# EAGLE design LB-01 (EAGLE 7.3.0)
PROJECT_NAME: LMB 01- Mixer; REVISION: 1
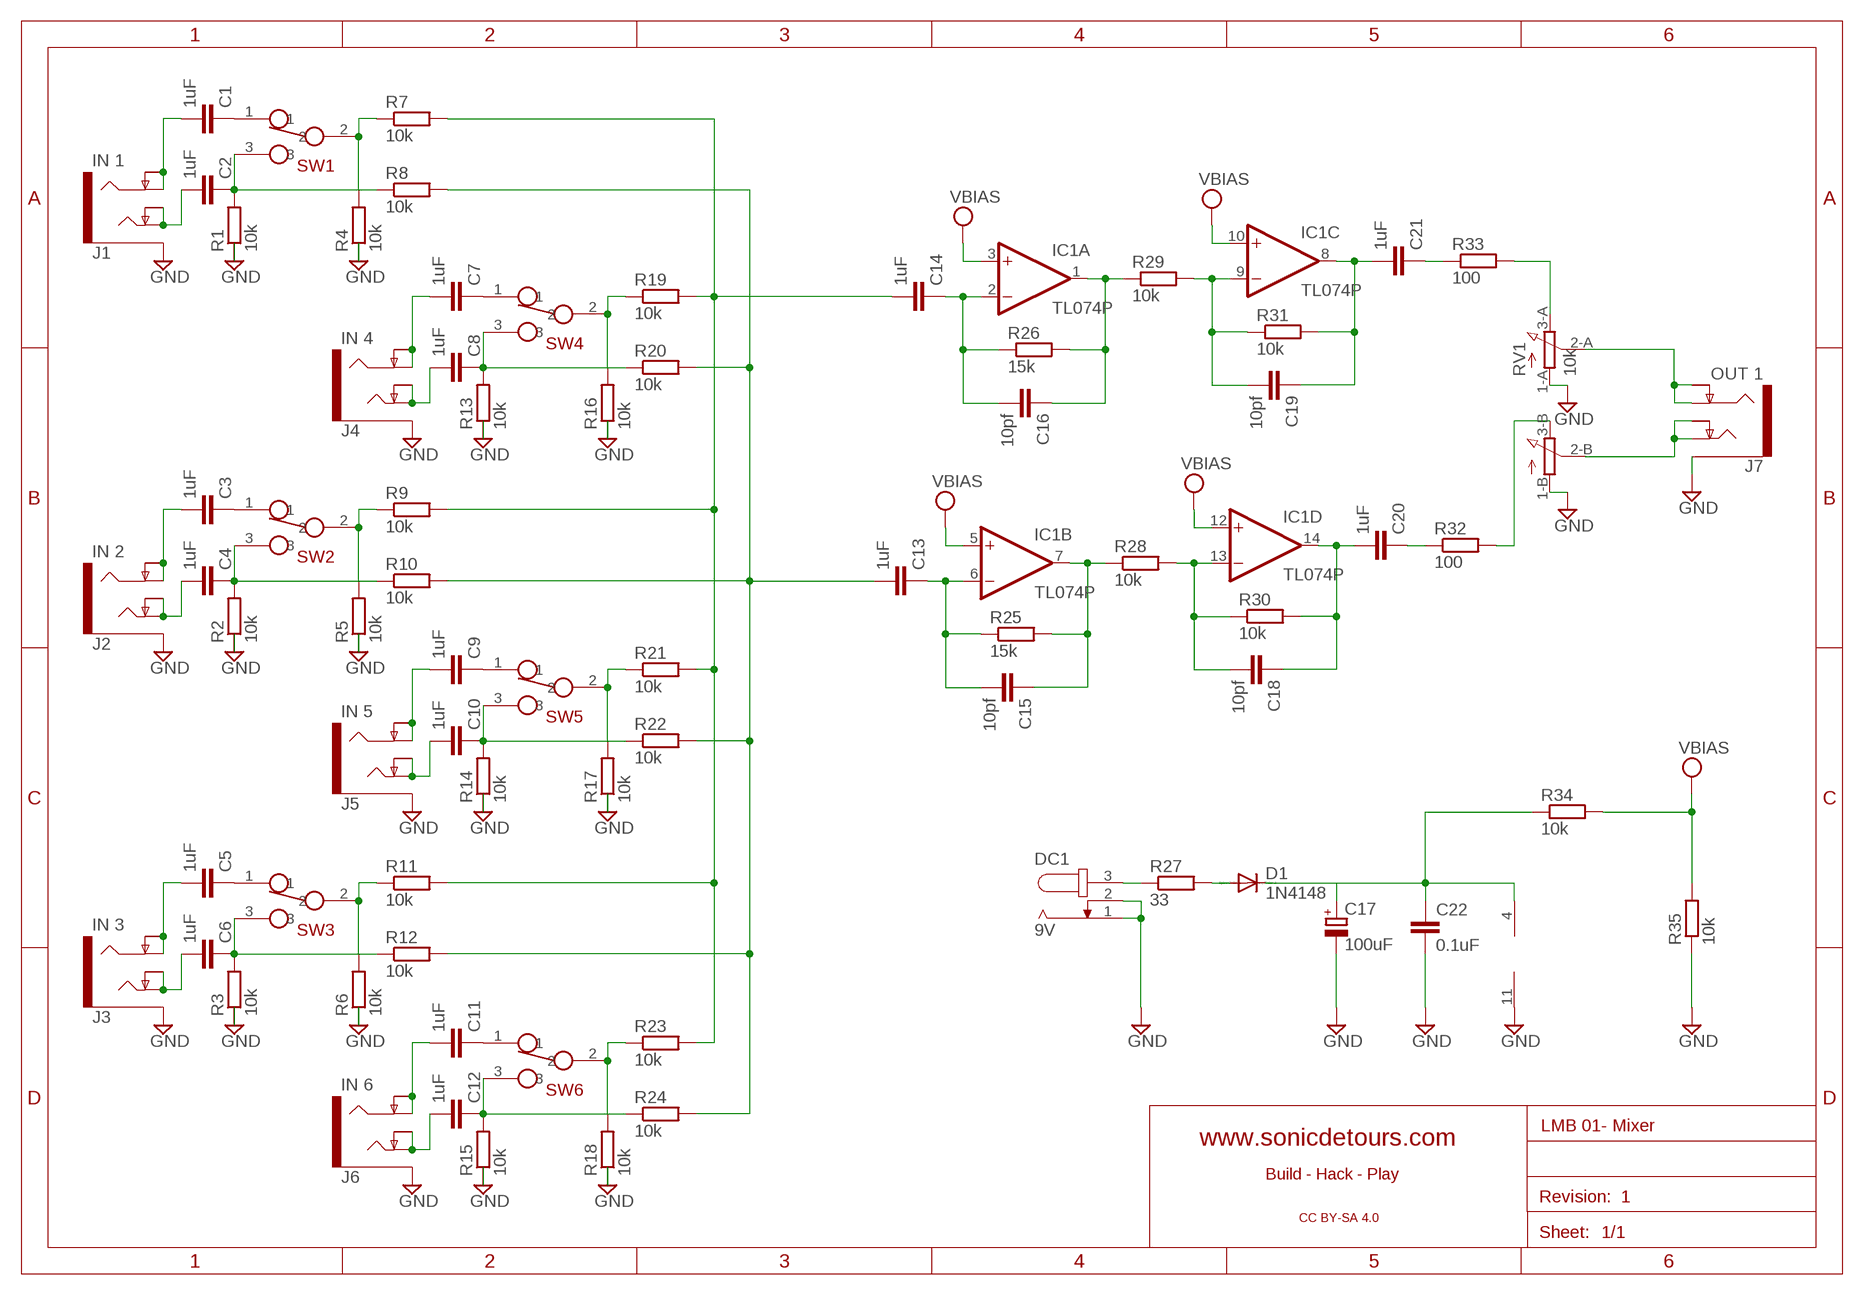
[diagram p0: schematic, sheet 1]

## Parts
C1  1uF  C50-50  [C-50-50]
C2  1uF  C50-50  [C-50-50]
C3  1uF  C50-50  [C-50-50]
C4  1uF  C50-50  [C-50-50]
C5  1uF  C50-50  [C-50-50]
C6  1uF  C50-50  [C-50-50]
C7  1uF  C50-50  [C-50-50]
C8  1uF  C50-50  [C-50-50]
C9  1uF  C50-50  [C-50-50]
C10  1uF  C50-50  [C-50-50]
C11  1uF  C50-50  [C-50-50]
C12  1uF  C50-50  [C-50-50]
C13  1uF  C50-50  [C-50-50]
C14  1uF  C50-50  [C-50-50]
C15  10pf  C25  [C-25]
C16  10pf  C25  [C-25]
C17  100uF  C-POL2.5-05  [C-POL-2.5-05]
C18  10pf  C25  [C-25]
C19  10pf  C25  [C-25]
C20  1uF  C50-50  [C-50-50]
C21  1uF  C50-50  [C-50-50]
C22  0.1uF  C25  [C-25]
D1  1N4148  1N4148DO35-10  [DO35-10]
DC1  9V  DC-JACK  [DC-JACK]
IC1  TL074P  [DIL14]
J1  IN 1  STEREO_JACK3.5MM  [STEREO_JACK_3.5MM]
J2  IN 2  STEREO_JACK3.5MM  [STEREO_JACK_3.5MM]
J3  IN 3  STEREO_JACK3.5MM  [STEREO_JACK_3.5MM]
J4  IN 4  STEREO_JACK3.5MM  [STEREO_JACK_3.5MM]
J5  IN 5  STEREO_JACK3.5MM  [STEREO_JACK_3.5MM]
J6  IN 6  STEREO_JACK3.5MM  [STEREO_JACK_3.5MM]
J7  OUT 1  STEREO_JACK3.5MM  [STEREO_JACK_3.5MM]
R1  10k  R  [R-7.62MM]
R2  10k  R  [R-7.62MM]
R3  10k  R  [R-7.62MM]
R4  10k  R  [R-7.62MM]
R5  10k  R  [R-7.62MM]
R6  10k  R  [R-7.62MM]
R7  10k  R  [R-7.62MM]
R8  10k  R  [R-7.62MM]
R9  10k  R  [R-7.62MM]
R10  10k  R  [R-7.62MM]
R11  10k  R  [R-7.62MM]
R12  10k  R  [R-7.62MM]
R13  10k  R  [R-7.62MM]
R14  10k  R  [R-7.62MM]
R15  10k  R  [R-7.62MM]
R16  10k  R  [R-7.62MM]
R17  10k  R  [R-7.62MM]
R18  10k  R  [R-7.62MM]
R19  10k  R  [R-7.62MM]
R20  10k  R  [R-7.62MM]
R21  10k  R  [R-7.62MM]
R22  10k  R  [R-7.62MM]
R23  10k  R  [R-7.62MM]
R24  10k  R  [R-7.62MM]
R25  15k  R  [R-7.62MM]
R26  15k  R  [R-7.62MM]
R27  33  R  [R-7.62MM]
R28  10k  R  [R-7.62MM]
R29  10k  R  [R-7.62MM]
R30  10k  R  [R-7.62MM]
R31  10k  R  [R-7.62MM]
R32  100  R  [R-7.62MM]
R33  100  R  [R-7.62MM]
R34  10k  R  [R-7.62MM]
R35  10k  R  [R-7.62MM]
RV1  10k  POT-DUALBOURNS-PTA4544  [POT-DUAL-PTA4544]
SW1  SWITCH-SPDT  [SWITCH-SPDT-SMALL]
SW2  SWITCH-SPDT  [SWITCH-SPDT-SMALL]
SW3  SWITCH-SPDT  [SWITCH-SPDT-SMALL]
SW4  SWITCH-SPDT  [SWITCH-SPDT-SMALL]
SW5  SWITCH-SPDT  [SWITCH-SPDT-SMALL]
SW6  SWITCH-SPDT  [SWITCH-SPDT-SMALL]

## Nets
GND: C17.- C22.2 DC1.1 DC1.2 IC1.11(P:V-) J1.SLEEVE(EARTH) J2.SLEEVE(EARTH) J3.SLEEVE(EARTH) J4.SLEEVE(EARTH) J5.SLEEVE(EARTH) J6.SLEEVE(EARTH) J7.SLEEVE(EARTH) R1.1 R2.1 R3.1 R4.1 R5.1 R6.1 R13.1 R14.1 R15.1 R16.1 R17.1 R18.1 R35.1 RV1.1-A(A-1) RV1.1-B(B-1)
N$1: C1.2 J1.RING J1.RING_DETECT(RING-NORM)
N$2: C7.2 J4.RING J4.RING_DETECT(RING-NORM)
N$3: C2.2 J1.TIP J1.TIP_DETECT(TIP-NORM)
N$4: C8.2 J4.TIP J4.TIP_DETECT(TIP-NORM)
N$5: C2.1 R1.2 R8.1 SW1.3
N$6: R4.2 R7.1 SW1.2
N$7: C8.1 R13.2 R20.1 SW4.3
N$8: C1.1 SW1.1
N$9: R16.2 R19.1 SW4.2
N$10: C7.1 SW4.1
N$11: C9.2 J5.RING J5.RING_DETECT(RING-NORM)
N$12: C10.2 J5.TIP J5.TIP_DETECT(TIP-NORM)
N$13: C10.1 R14.2 R22.1 SW5.3
N$14: R17.2 R21.1 SW5.2
N$15: C9.1 SW5.1
N$16: C3.2 J2.RING J2.RING_DETECT(RING-NORM)
N$17: C4.2 J2.TIP J2.TIP_DETECT(TIP-NORM)
N$18: C4.1 R2.2 R10.1 SW2.3
N$19: R5.2 R9.1 SW2.2
N$20: C3.1 SW2.1
N$21: C11.2 J6.RING J6.RING_DETECT(RING-NORM)
N$22: C12.2 J6.TIP J6.TIP_DETECT(TIP-NORM)
N$23: C12.1 R15.2 R24.1 SW6.3
N$24: R18.2 R23.1 SW6.2
N$29: DC1.3 R27.1
N$30: C17.+ D1.C
N$31: D1.A R27.2
N$32: C11.1 SW6.1
N$33: C5.2 J3.RING J3.RING_DETECT(RING-NORM)
N$34: C6.2 J3.TIP J3.TIP_DETECT(TIP-NORM)
N$35: C6.1 R3.2 R12.1 SW3.3
N$36: R6.2 R11.1 SW3.2
N$37: C5.1 SW3.1
N$38: C14.2 R7.2 R9.2 R11.2 R19.2 R21.2 R23.2
N$39: C13.2 R8.2 R10.2 R12.2 R20.2 R22.2 R24.2
N$40: R33.2 RV1.3-A(A-3)
N$45: C14.1 C16.2 IC1.2(A:-IN) R26.1
N$46: C16.1 IC1.1(A:OUT) R26.2 R29.1
N$47: C19.2 IC1.9(C:-IN) R29.2 R31.1
N$48: C19.1 C21.2 IC1.8(C:OUT) R31.2
N$49: C13.1 C15.2 IC1.6(B:-IN) R25.1
N$50: C15.1 IC1.7(B:OUT) R25.2 R28.1
N$51: C18.2 IC1.13(D:-IN) R28.2 R30.1
N$52: C18.1 C20.2 IC1.14(D:OUT) R30.2
N$53: R32.2 RV1.3-B(B-3)
N$55: C21.1 R33.1
N$56: C20.1 R32.1
N$57: J7.RING J7.RING_DETECT(RING-NORM) RV1.2-A(A-2)
N$58: J7.TIP J7.TIP_DETECT(TIP-NORM) RV1.2-B(B-2)
N$60: C22.1 IC1.4(P:V+) R34.1
VPP: IC1.3(A:+IN) IC1.5(B:+IN) IC1.10(C:+IN) IC1.12(D:+IN) R34.2 R35.2 ; supply symbol labelled VBIAS

## Library data of the parts
C1-C16 C18-C22 = sonic-detours:C
C17 = sonic-detours:C-POL
D1 = diode:1N4148: DIODE high speed (Philips)
DC1 = sonic-detours:DC-JACK
IC1 = sonic-detours:TL074: OP AMP
J1-J7 = sonic-detours:STEREO_JACK
R1-R35 = sonic-detours:R
RV1 = sonic-detours:POT-DUAL
SW1-SW6 = sonic-detours:SWITCH-SPDT

## Board
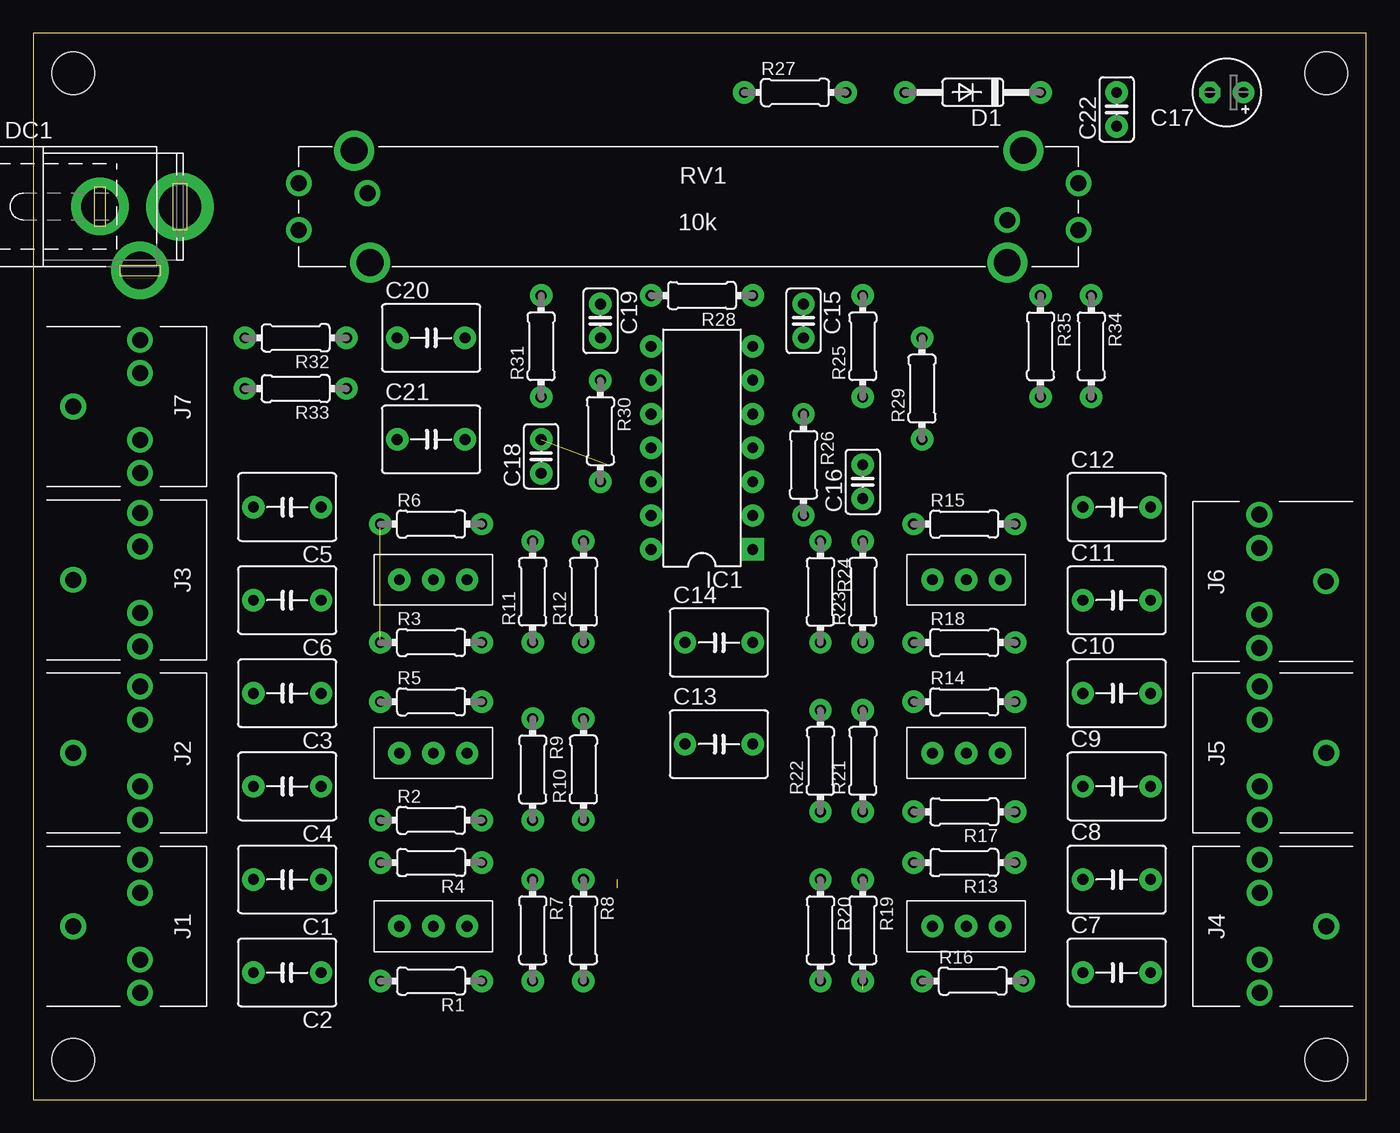
[diagram p1: board, top side]
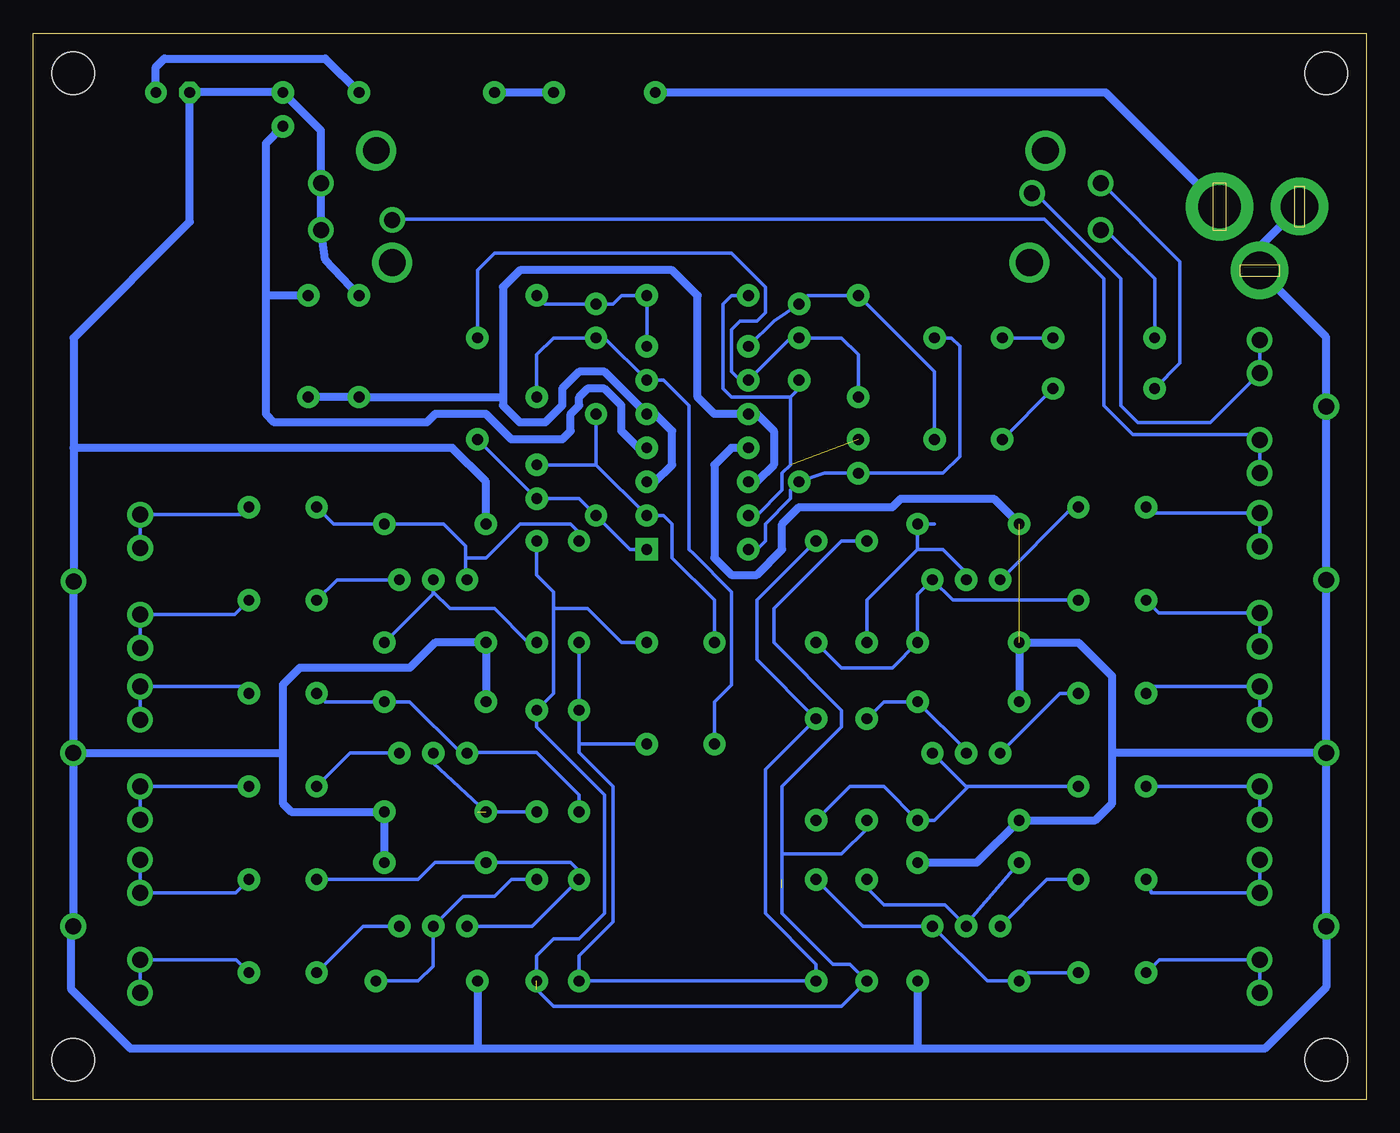
[diagram p2: board, bottom side, seen from below]

Size 100 x 80 mm. Coordinates in mm from the lower left corner, seen from the top.
Outline: 0,0 100,0 100,80 0,80 0,0
Copper layers (1*16): Top 0.035mm / dielectric 1.5mm / Bottom 0.035mm
Design rules "default *": minimum track width 10mil, minimum drill 24mil, track to track 10mil, track to pad 10mil, pad to pad 10mil, via to via 10mil, smd to smd 10mil, copper to edge 40mil, drill to drill 8mil, minimum pad ring 10mil, minimum via ring 8mil, stop-mask expansion 4mil, vias tented up to drill 0mil, thermal gap 10mil
Holes 3.2 mm at 3,77 3,3 97,3 97,77

### Footprints (pad centres in the part's own frame; a part is rotated, then mirrored left to right if it is on the bottom)
C-50-50 = drill 0.813 pad 1.676: 1 -2.54,0; 2 2.54,0
C-25 = drill 0.813 pad 1.676: 1 -1.27,0; 2 1.27,0
C-POL-2.5-05 = drill 0.813 pad 1.6: + -1.27,0 | drill 0.813 pad 1.6 octagon: - 1.27,0
DO35-10 = drill 0.813 pad 1.676: A 5.08,0; C -5.08,0
DC-JACK = drill 2.8 pad 4.318: 1 -3,0; 2 0,-4.8 | drill 3.2 pad 5.08: 3 3,0
DIL14 = drill 0.813 pad 1.676 square: 1 -7.62,-3.81 | drill 0.813 pad 1.676: 2 -5.08,-3.81; 3 -2.54,-3.81; 4 0,-3.81; 5 2.54,-3.81; 6 5.08,-3.81; 7 7.62,-3.81; 8 7.62,3.81; 9 5.08,3.81; 10 2.54,3.81; 11 0,3.81; 12 -2.54,3.81; 13 -5.08,3.81; 14 -7.62,3.81
STEREO_JACK_3.5MM = drill 1.2 pad 1.93: RING 5,-2; RING_DETECT 2.5,-2; SLEEVE 0,3; TIP -5,-2; TIP_DETECT -2.5,-2
R-7.62MM = drill 0.813 pad 1.676: 1 -3.81,0; 2 3.81,0
POT-DUAL-PTA4544 = drill 1.2 pad 1.93: 1-A 1.75,-58.42; 1-B -1.75,-58.42; 2-A 1,-5.07; 2-B -1,-53.07; 3-A 1.75,0.08; 3-B -1.75,0.08 | drill 2 pad 2.54: H-1 -4.2,-53.07; H-2 4.2,-54.27; H-3 -4.2,-5.27; H-4 4.2,-4.07
SWITCH-SPDT-SMALL = drill 0.8 pad 1.676: 1 -2.54,0; 2 0,0; 3 2.54,0

### Placement (x,y rotation side)
C1  19.05,16.51 180 top
C2  19.05,9.53 180 top
C3  19.05,30.48 180 top
C4  19.05,23.5 180 top
C5  19.05,44.45 180 top
C6  19.05,37.47 180 top
C7  81.28,9.53 0 top
C8  81.28,16.51 0 top
C9  81.28,23.5 0 top
C10  81.28,30.48 0 top
C11  81.28,37.47 0 top
C12  81.28,44.45 0 top
C13  51.44,26.67 0 top
C14  51.44,34.29 0 top
C15  57.78,58.42 270 top
C16  62.23,46.35 90 top
C17  89.53,75.56 180 top
C18  38.1,48.26 90 top
C19  42.55,58.42 270 top
C20  29.84,57.15 0 top
C21  29.84,49.53 0 top
C22  81.28,74.3 90 top
D1  70.48,75.56 180 top
DC1  8,67 0 top
IC1  50.16,48.9 90 top
J1  6,13 90 top
J2  6,26 90 top
J3  6,39 90 top
J4  94,13 270 top
J5  94,26 270 top
J6  93.98,38.88 270 top
J7  6,52 90 top
R1  29.84,8.89 180 top
R2  29.84,20.95 0 top
R3  29.84,34.29 0 top
R4  29.84,17.78 180 top
R5  29.84,29.84 0 top
R6  29.84,43.18 0 top
R7  37.47,12.7 270 top
R8  41.27,12.7 270 top
R9  37.47,24.77 270 top
R10  41.27,24.77 90 top
R11  37.47,38.1 90 top
R12  41.27,38.1 90 top
R13  69.85,17.78 180 top
R14  69.85,29.84 0 top
R15  69.85,43.18 0 top
R16  70.48,8.89 0 top
R17  69.85,21.59 180 top
R18  69.85,34.29 0 top
R19  62.23,12.7 270 top
R20  59.05,12.7 270 top
R21  62.23,25.4 90 top
R22  59.05,25.4 90 top
R23  62.23,38.1 90 top
R24  59.05,38.1 270 top
R25  62.23,56.52 90 top
R26  57.78,47.62 270 top
R27  57.15,75.56 0 top
R28  50.16,60.33 180 top
R29  66.67,53.34 90 top
R30  42.55,50.16 270 top
R31  38.1,56.52 90 top
R32  19.68,57.15 180 top
R33  19.68,53.34 180 top
R34  79.38,56.52 270 top
R35  75.56,56.52 270 top
RV1  20,67 90 top
SW1  30,13 0 top
SW2  30,26 0 top
SW3  30,39 0 top
SW4  70,13 180 top
SW5  70,26 180 top
SW6  70,39 180 top

### Tracks (layer width: path | path; a pad name or v marks a point on that pad's centre or on a via)
GND  (1 unrouted)
  Bottom 0.406: 97,38.86 J6.SLEEVE
  Bottom 0.61: IC1.11 47.62,48.9 48.9,47.62 48.9,40.64 47.62,39.37 45.72,39.37 43.81,41.27 43.81,43.18 42.55,44.45 35.56,44.45 34.92,45.09 27.94,45.09 R6.1 | R35.1 78.11,63.03 RV1.1-B RV1.1-A 78.42,72.7 C22.2 C17.- 88.27,65.86 96.98,57.15 96.98,48.9 | 96.98,48.9 J6.SLEEVE | 97,38.86 J5.SLEEVE | J5.SLEEVE J4.SLEEVE 97.16,12.85 97.16,8.26 92.71,3.81 66.67,3.81 | 33.66,3.81 7.62,3.81 3,8.43 J1.SLEEVE J2.SLEEVE | 33.66,3.81 66.67,3.81 | J2.SLEEVE J3.SLEEVE J7.SLEEVE 3,57.2 DC1.2 8,64 DC1.1 | R5.1 R3.1 21.59,34.29 19.05,31.75 19.05,26.04 | 19.05,26.04 3.04,26.04 J2.SLEEVE | R4.1 29.21,17.78 R2.1 20.32,20.95 19.05,22.23 19.05,26.04 | R1.1 33.66,3.81 | R16.1 66.67,3.81 | R15.1 66.04,46.35 68.58,48.9 96.98,48.9 | R14.1 R18.1 69.85,34.29 71.75,32.38 80.01,32.38 81.28,31.11 81.28,26.04 | J5.SLEEVE 81.31,26 81.28,26.04 | R13.1 R17.1 80.64,21.59 81.28,22.23 81.28,26.04
N$1
  Bottom 0.254: J1.RING J1.RING_DETECT 16.14,15.5 C1.2
N$2
  Bottom 0.254: J4.RING J4.RING_DETECT 84.8,10.5 C7.2
N$3
  Bottom 0.254: J1.TIP J1.TIP_DETECT 15.54,10.5 C2.2
N$4
  Bottom 0.254: C8.2 84.83,15.5 J4.TIP_DETECT J4.TIP
N$5
  Bottom 0.254: C2.1 25.4,9.53 R1.2 28.43,8.89 SW1.3 37.77,13 R8.1
N$6
  Bottom 0.254: R4.2 30,13.18 SW1.2 31.61,14.61 36.2,14.61 37.47,15.88 R7.1
N$7
  Bottom 0.254: SW4.3 62.56,13 R20.1 59.05,17.14 59.69,17.78 R13.2 69.85,17.78 71.12,16.51 C8.1
N$8
  Bottom 0.254: C1.1 23.95,16.51 SW1.1
N$9
  Bottom 0.254: R19.1 64.14,16.51 65.41,15.24 67.76,15.24 SW4.2 70,10.01 71.12,8.89 R16.2
N$10
  Bottom 0.254: SW4.1 75.27,13 C7.1
N$11
  Bottom 0.254: J5.RING J5.RING_DETECT C9.2
N$12
  Bottom 0.254: J5.TIP_DETECT J5.TIP 84.34,31 C10.2
N$13
  Bottom 0.254: R22.1 59.05,22.86 62.23,26.04 67.42,26.04 SW5.3 67.91,26 71.75,29.84 R14.2 78.11,29.84 C10.1
N$14  (1 unrouted)
  Bottom 0.254: SW5.2 70,25.25 R17.2 | R21.1 66.67,21.59
N$15
  Bottom 0.254: SW5.1 76.23,26 C9.1
N$16
  Bottom 0.254: J2.RING_DETECT J2.RING 15.99,31 C3.2
N$17
  Bottom 0.254: J2.TIP J2.TIP_DETECT C4.2
N$18
  Bottom 0.254: C4.1 29.84,23.5 | SW2.3 30.04,23.5 29.84,23.5 | 29.84,23.5 32.38,20.95 R2.2 36.2,23.5 38.73,23.5 R10.1
N$19
  Bottom 0.254: SW2.2 30,26.19 R5.2 36.2,29.84 R9.1
N$20
  Bottom 0.254: C3.1 22.98,30.48 SW2.1
N$21
  Bottom 0.254: J6.RING J6.RING_DETECT 84.91,36.38 C11.2
N$22
  Bottom 0.254: J6.TIP_DETECT J6.TIP 84.39,43.88 C12.2
N$23
  Bottom 0.254: SW6.3 67.58,39 67.58,40.64 | C12.1 77.47,43.18 R15.2 69.22,43.18 67.58,41.54 67.58,40.64 | R24.1 59.05,42.55 59.69,43.18 63.5,43.18 66.04,40.64 67.58,40.64
N$24
  Bottom 0.254: SW6.2 70,38.1 | 70,38.1 70,37.95 R18.2 | R23.1 62.87,34.29 65.41,36.83 68.73,36.83 70,38.1
N$29
  Bottom 0.61: R27.1 19.57,75.56 DC1.3
N$30
  Bottom 0.254: C17.+ 90.81,76.2
  Bottom 0.61: 90.81,76.2 90.81,77.47 90.17,78.11 78.11,78.11 D1.C
N$31
  Bottom 0.61: D1.A R27.2
N$32
  Bottom 0.254: SW6.1 77.2,39 C11.1
N$33
  Bottom 0.254: J3.RING_DETECT J3.RING 16.06,44 C5.2
N$34
  Bottom 0.254: J3.TIP J3.TIP_DETECT 15.54,36.5 C6.2
N$35
  Bottom 0.254: C6.1 31,37.47 SW3.3 33.66,37.88 R3.2 35.56,32.38 39.37,32.38 R12.1
N$36
  Bottom 0.254: 32.38,43.18 R6.2 33.66,41.27 | R11.1 37.47,37.47 34.29,40.64 33.66,41.27 | SW3.2 30,39.52 31.75,41.27 33.66,41.27
N$37
  Bottom 0.254: C5.1 22.01,44.45 SW3.1
N$38  (2 unrouted)
  Bottom 0.254: 43.81,16.51 43.81,13.97 40.01,10.16 38.73,10.16 R7.2 39.37,6.99 60.96,6.99 62.23,8.26 62.23,10.79 60.96,12.06 59.05,12.06 57.15,13.97 57.15,22.86 62.23,27.94 R21.2 60.96,30.48 60.96,36.83 | R11.2 39.37,41.91 44.45,36.83 44.45,34.29 39.37,29.21 39.37,27.94 43.81,23.5 43.81,18.41 | 43.81,18.41 43.81,15.88 | R9.2 37.47,20.32 39.37,18.41 43.81,18.41 | C14.2 55.88,34.29 58.42,36.83 60.96,36.83 | R23.2 62.23,39.37 60.96,38.1 60.96,36.83
N$39
  Bottom 0.254: R12.2 45.72,37.47 45.72,33.02 R10.2 45.09,24.77 45.09,13.97 41.27,10.16 R8.2 R20.2 59.05,10.79 56.52,13.34 56.52,23.5 59.05,26.04 59.05,26.67 | 59.05,26.67 R22.2 R24.2 | C13.2 59.05,26.67
N$40
  Bottom 0.254: RV1.3-A 19.92,68.81 | 19.92,68.81 20.32,69.22 | 19.92,68.81 13.97,62.87 13.97,55.24 R33.2
N$45
  Bottom 0.254: C14.1 48.9,37.47 52.07,40.64 52.07,43.18 52.7,43.81 IC1.2 57.78,47.62 | 57.78,47.62 C16.2 | R26.1 57.78,47.62
N$46
  Bottom 0.254: R29.1 C16.1 59.05,45.09 R26.2 55.24,41.27 IC1.1
N$47
  Bottom 0.254: R29.2 66.67,62.23 65.41,63.5 47.62,63.5 45.09,60.96 45.09,59.05 45.72,58.42 46.99,58.42 47.62,57.78 47.62,54.61 46.99,53.98 IC1.9 43.18,57.15 C19.2 39.37,57.15 38.1,55.88 R31.1
N$48
  Bottom 0.254: C21.2 32.38,54.61 R31.2 41.91,60.33 C19.1 44.45,58.42 IC1.8
N$49
  Bottom 0.254: C13.1 48.9,29.84 47.62,31.11 47.62,38.1 50.48,40.96 50.8,41.27 50.8,52.07 52.7,53.98 IC1.6 57.15,57.15 C15.2 60.96,57.15 62.23,55.88 R25.1
N$50
  Bottom 0.254: R25.2 61.59,59.69 C15.1 56.52,59.69 55.88,60.33 R28.1 IC1.7
N$51  (1 unrouted)
  Bottom 0.254: 43.18,52.7 47.62,52.7 48.26,53.34 48.26,59.69 47.62,60.33 R28.2 | R30.1 42.55,53.34 43.18,52.7 | IC1.13 45.72,43.81 43.81,45.72 43.81,46.99 43.18,47.62 43.18,52.7
N$52
  Bottom 0.254: C20.2 31.11,57.15 30.48,56.52 30.48,48.26 31.75,46.99 C18.1 40.64,46.99 R30.2 43.18,45.72 43.18,45.09 45.09,43.18 45.09,41.91 45.72,41.27 IC1.14
N$53
  Bottom 0.254: RV1.3-B 19.53,65.25 15.88,61.59 R32.2
N$55
  Bottom 0.254: R33.1 C21.1
N$56
  Bottom 0.254: R32.1 C20.1
N$57
  Bottom 0.254: 8.15,57.15 J7.RING J7.RING_DETECT 11.7,50.8 17.14,50.8 18.41,52.07 18.41,61.59 24.82,68 RV1.2-A
N$58
  Bottom 0.254: J7.TIP J7.TIP_DETECT 8,49.91 17.52,49.91 19.68,52.07 19.68,61.59 24.13,66.04 73.03,66.04 RV1.2-B
N$60
  Bottom 0.61: IC1.4 54.61,48.9 55.88,50.16 55.88,52.07 57.15,53.34 58.42,53.34 59.05,52.7 59.05,52.07 59.69,51.44 59.69,50.16 60.33,49.53 64.14,49.53 66.04,51.44 69.85,51.44 70.48,50.8 81.92,50.8 82.55,51.44 82.55,60.33 | R34.1 82.55,60.33 | 82.55,60.33 82.55,69.85 82.55,71.75 C22.1
VPP
  Bottom 0.61: IC1.12 45.72,46.35 44.45,47.62 44.45,50.16 45.72,51.44 IC1.10 48.9,51.44 50.16,52.7 50.16,60.33 52.07,62.23 63.5,62.23 64.77,60.96 64.77,52.7 | R34.2 R35.2 64.77,52.7 | IC1.3 53.34,46.35 52.07,47.62 52.07,50.16 53.34,51.44 IC1.5 57.15,54.61 59.05,54.61 60.33,53.34 60.33,52.07 61.59,50.8 63.5,50.8 64.77,52.07 64.77,52.7